# EAGLE schematic AteGates (EAGLE 6.6.0)
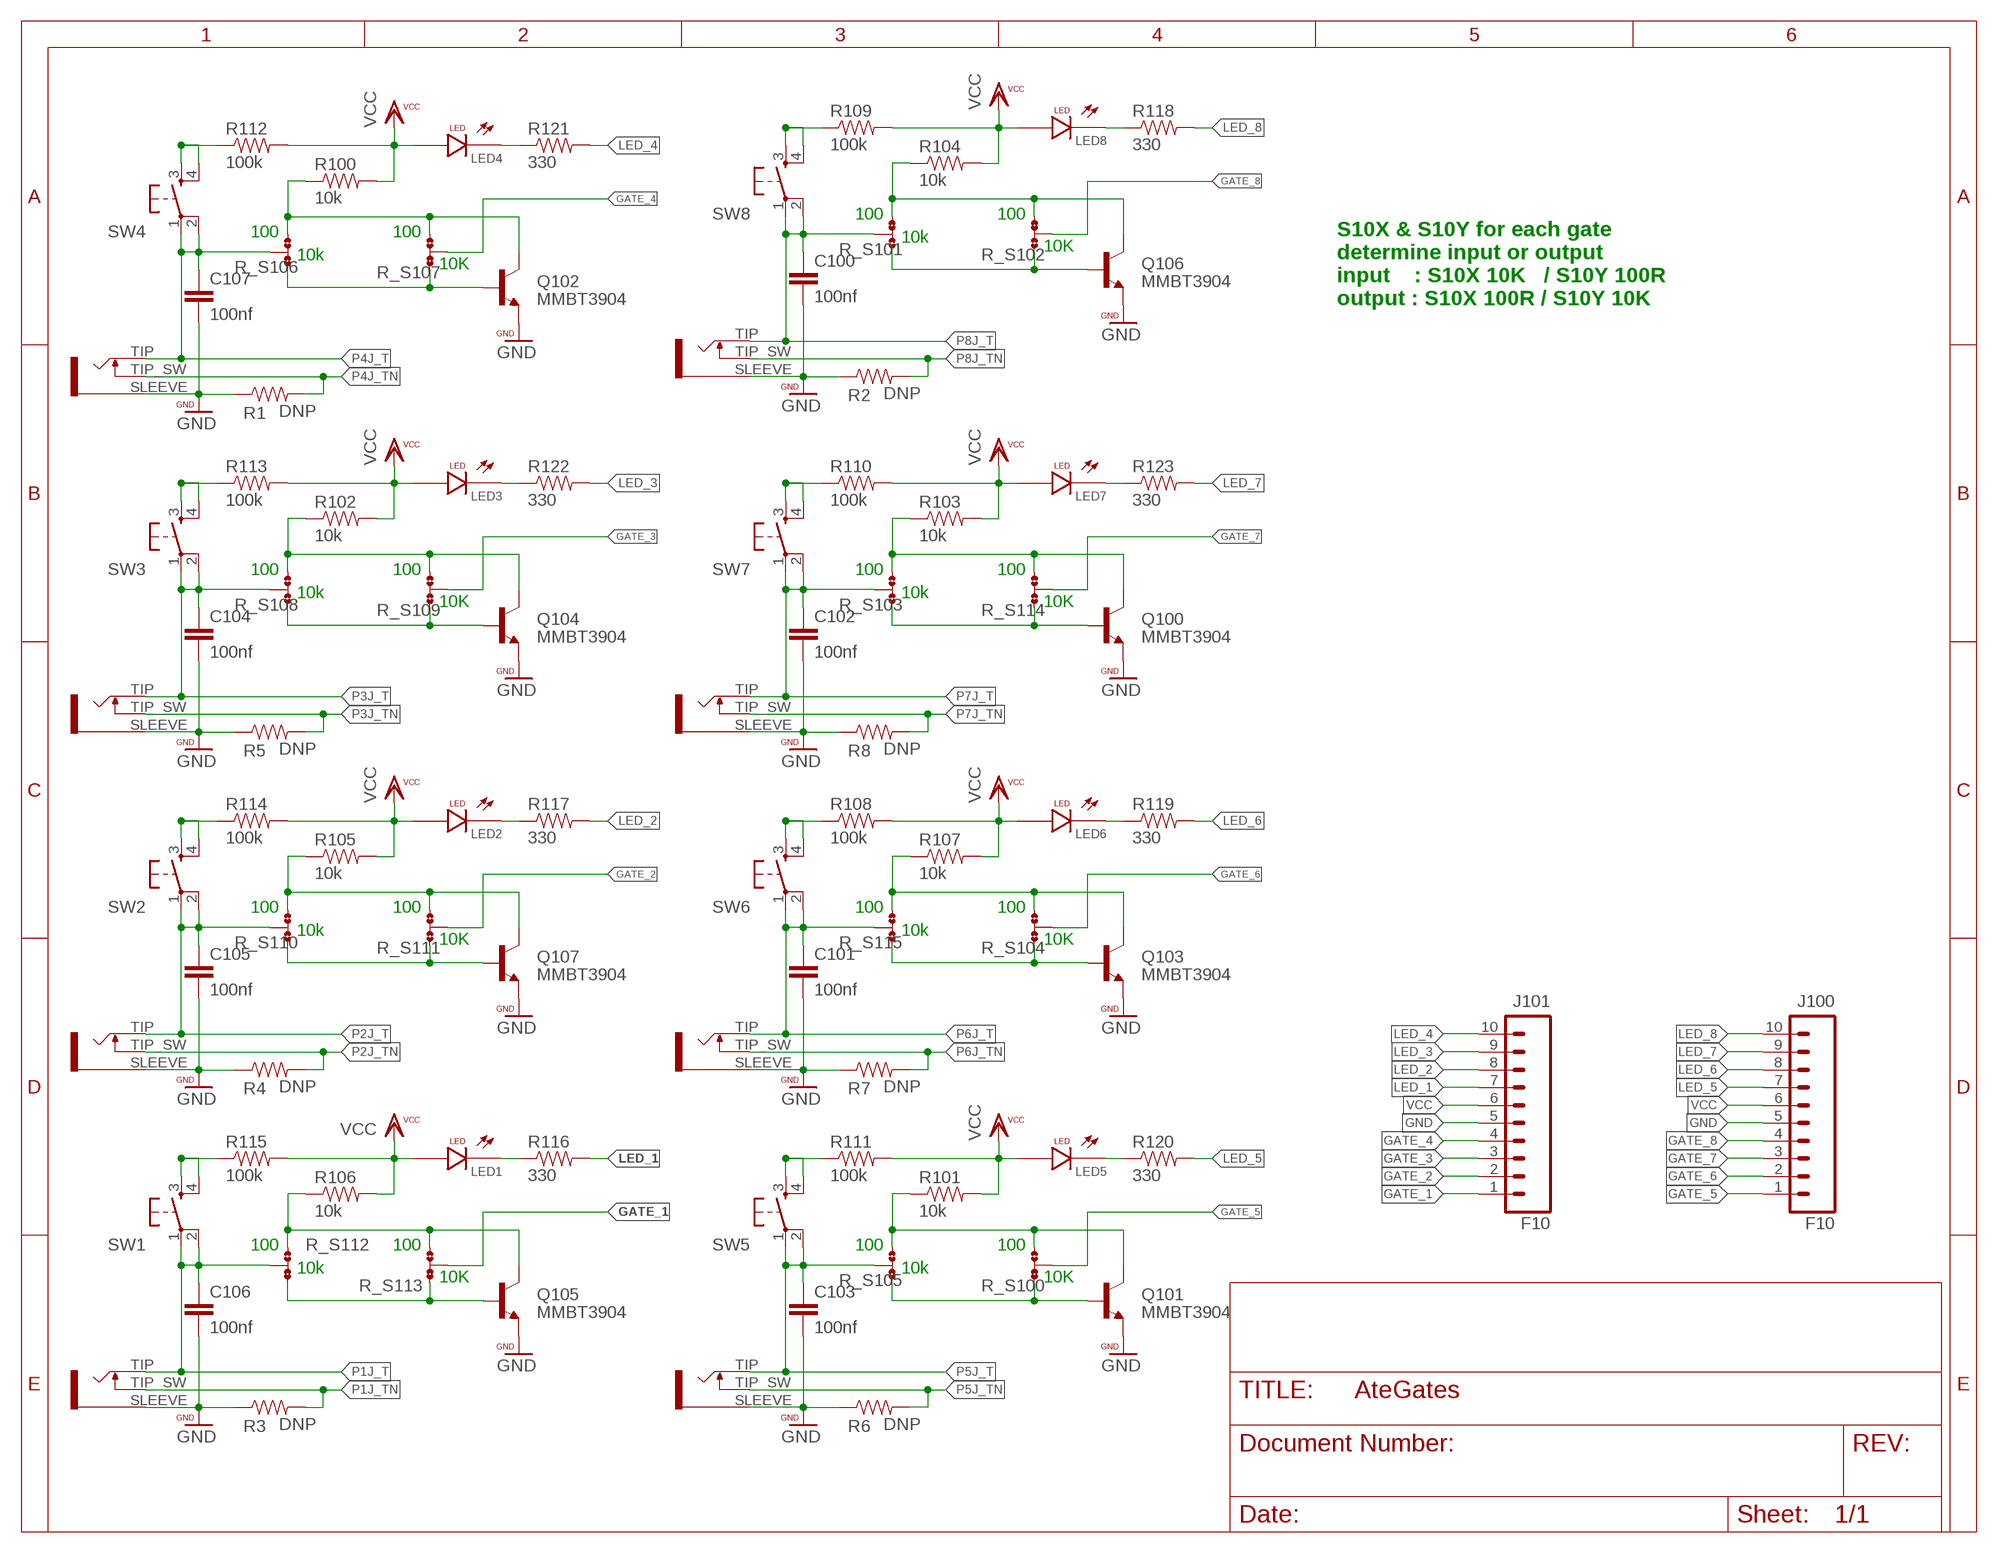
[diagram p0: schematic, sheet 1]

## Parts
C100  100nf  CAP0603-CAP  [0603-CAP]
C101  100nf  CAP0603-CAP  [0603-CAP]
C102  100nf  CAP0603-CAP  [0603-CAP]
C103  100nf  CAP0603-CAP  [0603-CAP]
C104  100nf  CAP0603-CAP  [0603-CAP]
C105  100nf  CAP0603-CAP  [0603-CAP]
C106  100nf  CAP0603-CAP  [0603-CAP]
C107  100nf  CAP0603-CAP  [0603-CAP]
J100  F10  M10SILK_FEMALE_PTH  [1X10_OCTO]
J101  F10  M10SILK_FEMALE_PTH  [1X10_OCTO]
LED1  LED  [LED3MM]
LED2  LED  [LED3MM]
LED3  LED  [LED3MM]
LED4  LED  [LED3MM]
LED5  LED  [LED3MM]
LED6  LED  [LED3MM]
LED7  LED  [LED3MM]
LED8  LED  [LED3MM]
P1J  JACK-3_5MM-MONO-SW-WQP_PJ302-12  [WQP_PJ301M-12]
P2J  JACK-3_5MM-MONO-SW-WQP_PJ302-12  [WQP_PJ301M-12]
P3J  JACK-3_5MM-MONO-SW-WQP_PJ302-12  [WQP_PJ301M-12]
P4J  JACK-3_5MM-MONO-SW-WQP_PJ302-12  [WQP_PJ301M-12]
P5J  JACK-3_5MM-MONO-SW-WQP_PJ302-12  [WQP_PJ301M-12]
P6J  JACK-3_5MM-MONO-SW-WQP_PJ302-12  [WQP_PJ301M-12]
P7J  JACK-3_5MM-MONO-SW-WQP_PJ302-12  [WQP_PJ301M-12]
P8J  JACK-3_5MM-MONO-SW-WQP_PJ302-12  [WQP_PJ301M-12]
Q100  MMBT3904  MMBT3904LT1-NPN-SOT23-BEC  [SOT23-BEC]
Q101  MMBT3904  MMBT3904LT1-NPN-SOT23-BEC  [SOT23-BEC]
Q102  MMBT3904  MMBT3904LT1-NPN-SOT23-BEC  [SOT23-BEC]
Q103  MMBT3904  MMBT3904LT1-NPN-SOT23-BEC  [SOT23-BEC]
Q104  MMBT3904  MMBT3904LT1-NPN-SOT23-BEC  [SOT23-BEC]
Q105  MMBT3904  MMBT3904LT1-NPN-SOT23-BEC  [SOT23-BEC]
Q106  MMBT3904  MMBT3904LT1-NPN-SOT23-BEC  [SOT23-BEC]
Q107  MMBT3904  MMBT3904LT1-NPN-SOT23-BEC  [SOT23-BEC]
R1  DNP  RESISTOR0603-RES  [0603-RES]
R2  DNP  RESISTOR0603-RES  [0603-RES]
R3  DNP  RESISTOR0603-RES  [0603-RES]
R4  DNP  RESISTOR0603-RES  [0603-RES]
R5  DNP  RESISTOR0603-RES  [0603-RES]
R6  DNP  RESISTOR0603-RES  [0603-RES]
R7  DNP  RESISTOR0603-RES  [0603-RES]
R8  DNP  RESISTOR0603-RES  [0603-RES]
R100  10k  RESISTOR0603-RES  [0603-RES]
R101  10k  RESISTOR0603-RES  [0603-RES]
R102  10k  RESISTOR0603-RES  [0603-RES]
R103  10k  RESISTOR0603-RES  [0603-RES]
R104  10k  RESISTOR0603-RES  [0603-RES]
R105  10k  RESISTOR0603-RES  [0603-RES]
R106  10k  RESISTOR0603-RES  [0603-RES]
R107  10k  RESISTOR0603-RES  [0603-RES]
R108  100k  RESISTOR0603-RES  [0603-RES]
R109  100k  RESISTOR0603-RES  [0603-RES]
R110  100k  RESISTOR0603-RES  [0603-RES]
R111  100k  RESISTOR0603-RES  [0603-RES]
R112  100k  RESISTOR0603-RES  [0603-RES]
R113  100k  RESISTOR0603-RES  [0603-RES]
R114  100k  RESISTOR0603-RES  [0603-RES]
R115  100k  RESISTOR0603-RES  [0603-RES]
R116  330  RESISTOR0603-RES  [0603-RES]
R117  330  RESISTOR0603-RES  [0603-RES]
R118  330  RESISTOR0603-RES  [0603-RES]
R119  330  RESISTOR0603-RES  [0603-RES]
R120  330  RESISTOR0603-RES  [0603-RES]
R121  330  RESISTOR0603-RES  [0603-RES]
R122  330  RESISTOR0603-RES  [0603-RES]
R123  330  RESISTOR0603-RES  [0603-RES]
R_S100  JMP-3-NO-0603  [JMP-3-NO-0603]
R_S101  100  JMP-3-NO-0603  [JMP-3-NO-0603]
R_S102  JMP-3-NO-0603  [JMP-3-NO-0603]
R_S103  100  JMP-3-NO-0603  [JMP-3-NO-0603]
R_S104  JMP-3-NO-0603  [JMP-3-NO-0603]
R_S105  100  JMP-3-NO-0603  [JMP-3-NO-0603]
R_S106  100  JMP-3-NO-0603  [JMP-3-NO-0603]
R_S107  JMP-3-NO-0603  [JMP-3-NO-0603]
R_S108  100  JMP-3-NO-0603  [JMP-3-NO-0603]
R_S109  JMP-3-NO-0603  [JMP-3-NO-0603]
R_S110  100  JMP-3-NO-0603  [JMP-3-NO-0603]
R_S111  JMP-3-NO-0603  [JMP-3-NO-0603]
R_S112  100  JMP-3-NO-0603  [JMP-3-NO-0603]
R_S113  JMP-3-NO-0603  [JMP-3-NO-0603]
R_S114  JMP-3-NO-0603  [JMP-3-NO-0603]
R_S115  100  JMP-3-NO-0603  [JMP-3-NO-0603]
SW1  TAC_SWITCHPTH  [TACTILE-PTH]
SW2  TAC_SWITCHPTH  [TACTILE-PTH]
SW3  TAC_SWITCHPTH  [TACTILE-PTH]
SW4  TAC_SWITCHPTH  [TACTILE-PTH]
SW5  TAC_SWITCHPTH  [TACTILE-PTH]
SW6  TAC_SWITCHPTH  [TACTILE-PTH]
SW7  TAC_SWITCHPTH  [TACTILE-PTH]
SW8  TAC_SWITCHPTH  [TACTILE-PTH]

## Nets
GATE_1: J101.1 R_S113.2
GATE_2: J101.2 R_S111.2
GATE_3: J101.3 R_S109.2
GATE_4: J101.4 R_S107.2
GATE_5: J100.1 R_S100.2
GATE_6: J100.2 R_S104.2
GATE_7: J100.3 R_S114.2
GATE_8: J100.4 R_S102.2
GND: C100.2 C101.2 C102.2 C103.2 C104.2 C105.2 C106.2 C107.2 J100.5 J101.5 P1J.SLEEVE P2J.SLEEVE P3J.SLEEVE P4J.SLEEVE P5J.SLEEVE P6J.SLEEVE P7J.SLEEVE P8J.SLEEVE Q100.E Q101.E Q102.E Q103.E Q104.E Q105.E Q106.E Q107.E R1.1 R2.1 R3.1 R4.1 R5.1 R6.1 R7.1 R8.1
GTI_1_LEDK: LED1.K(CATHODE) R116.1
GTI_1_LEDK1: LED2.K(CATHODE) R117.1
GTI_1_LEDK2: LED3.K(CATHODE) R122.1
GTI_1_LEDK3: LED4.K(CATHODE) R121.1
GTI_1_LEDK4: LED5.K(CATHODE) R120.1
GTI_1_LEDK5: LED6.K(CATHODE) R119.1
GTI_1_LEDK6: LED7.K(CATHODE) R123.1
GTI_1_LEDK7: LED8.K(CATHODE) R118.1
LED_1: J101.7 R116.2
LED_2: J101.8 R117.2
LED_3: J101.9 R122.2
LED_4: J101.10 R121.2
LED_5: J100.7 R120.2
LED_6: J100.8 R119.2
LED_7: J100.9 R123.2
LED_8: J100.10 R118.2
P1J_T: C106.1 P1J.TIP R_S112.2 SW1.1 SW1.2
P1J_TN: P1J.TIP_SW R3.2
P2J_T: C105.1 P2J.TIP R_S110.2 SW2.1 SW2.2
P2J_TN: P2J.TIP_SW R4.2
P3J_T: C104.1 P3J.TIP R_S108.2 SW3.1 SW3.2
P3J_TN: P3J.TIP_SW R5.2
P4J_T: C107.1 P4J.TIP R_S106.2 SW4.1 SW4.2
P4J_TN: P4J.TIP_SW R1.2
P5J_T: C103.1 P5J.TIP R_S105.2 SW5.1 SW5.2
P5J_TN: P5J.TIP_SW R6.2
P6J_T: C101.1 P6J.TIP R_S115.2 SW6.1 SW6.2
P6J_TN: P6J.TIP_SW R7.2
P7J_T: C102.1 P7J.TIP R_S103.2 SW7.1 SW7.2
P7J_TN: P7J.TIP_SW R8.2
P8J_T: C100.1 P8J.TIP R_S101.2 SW8.1 SW8.2
P8J_TN: P8J.TIP_SW R2.2
Q1_B: Q105.B R_S112.3 R_S113.3
Q1_B1: Q107.B R_S110.3 R_S111.3
Q1_B2: Q104.B R_S108.3 R_S109.3
Q1_B3: Q102.B R_S106.3 R_S107.3
Q1_B4: Q101.B R_S100.3 R_S105.3
Q1_B5: Q103.B R_S104.3 R_S115.3
Q1_B6: Q100.B R_S103.3 R_S114.3
Q1_B7: Q106.B R_S101.3 R_S102.3
Q1_C: Q105.C R106.1 R_S112.1 R_S113.1
Q1_C1: Q107.C R105.1 R_S110.1 R_S111.1
Q1_C2: Q104.C R102.1 R_S108.1 R_S109.1
Q1_C3: Q102.C R100.1 R_S106.1 R_S107.1
Q1_C4: Q101.C R101.1 R_S100.1 R_S105.1
Q1_C5: Q103.C R107.1 R_S104.1 R_S115.1
Q1_C6: Q100.C R103.1 R_S103.1 R_S114.1
Q1_C7: Q106.C R104.1 R_S101.1 R_S102.1
SW1: R115.1 SW1.3 SW1.4
SW2: R114.1 SW2.3 SW2.4
SW3: R113.1 SW3.3 SW3.4
SW4: R112.1 SW4.3 SW4.4
SW5: R111.1 SW5.3 SW5.4
SW6: R108.1 SW6.3 SW6.4
SW7: R110.1 SW7.3 SW7.4
SW8: R109.1 SW8.3 SW8.4
VCC: J100.6 J101.6 LED1.A(ANODE) LED2.A(ANODE) LED3.A(ANODE) LED4.A(ANODE) LED5.A(ANODE) LED6.A(ANODE) LED7.A(ANODE) LED8.A(ANODE) R100.2 R101.2 R102.2 R103.2 R104.2 R105.2 R106.2 R107.2 R108.2 R109.2 R110.2 R111.2 R112.2 R113.2 R114.2 R115.2

## Notes on the sheet
- 100 | 100
- 100 | 100
- 10k
- 10K
- 10k
- 10K
- S10X & S10Y for each gate
  determine input or output
  input    : S10X 10K   / S10Y 100R
  output : S10X 100R / S10Y 10K
- 100 | 100 | 100 | 100
- 10k | 10k
- 10K | 10K
- 100 | 100 | 100 | 100
- 10k | 10k
- 10K | 10K
- 100 | 100 | 100 | 100
- 10k | 10k
- 10K | 10K

## Library data of the parts
C100-C107 = PatternAgents-ProtoPads:CAP: Capacitor Standard 0603 ceramic capacitor, and 0.1" leaded capacitor.
J100 J101 = oXo_Connectors:M10: Header 10 Standard 10-pin 0.1" header. Use with straight break away headers (SKU : PRT-00116), right angle break away headers (PRT-00553), swiss pins (PRT-00743), machine pins (PRT-00117), and female headers (PRT-00115).; PROD_ID: CONN-11563
LED1-LED8 = halcyonmod_Optoelectronics:LED
P1J P2J P3J P4J P5J P6J P7J P8J = oXo_Connectors:JACK-3_5MM-MONO-SW: Jack, 3.5mm, RIght Angle, Though-Hole
Q100-Q107 = transistor:*-NPN-: NPN Transistror BF959 corrected 2008.03.06
R1-R8 R100-R123 = PatternAgents-ProtoPads:RESISTOR: Resistor Basic schematic elements and footprints for 0603, 1206, and PTH resistors.
R_S100-R_S115 = PatternAgents-ProtoPads:JMP-3-NO: Three Terminal Jumper - Normally Open All Pads Open (unconnected) PatternAgents ProtoPads Library Schematic and PCB layout libraries for design patterns by PatternAgents. For the CADSoft Eagle CAD program : http://www.cadsoftusa.com/download-eagle/ Source LBR : http://www.patternagents.com Github : https://github.com/PatternAgents License : http://creativecommons.org/licenses/by-sa/4.0/ (Creative Commons 4.0) THIS SOFTWARE IS PROVIDED BY THE CONTRIBUTORS "AS IS" AND WITHOUT ANY EXPRESS OR IMPLIED WARRANTIES, INCLUDING, BUT NOT LIMITED TO, THE IMPLIED WARRANTIES OF MERCHANTABILITY AND FITNESS FOR A PARTICULAR PURPOSE ARE DISCLAIMED. IN NO EVENT SHALL THE COPYRIGHT OWNER OR CONTRIBUTORS BE LIABLE FOR ANY DIRECT, INDIRECT, INCIDENTAL, SPECIAL, EXEMPLARY, OR CONSEQUENTIAL DAMAGES (INCLUDING, BUT NOT LIMITED TO, PROCUREMENT OF SUBSTITUTE GOODS OR SERVICES; LOSS OF USE, DATA, OR PROFITS; OR BUSINESS INTERRUPTION) HOWEVER CAUSED AND ON ANY THEORY OF LIABILITY, WHETHER IN CONTRACT, STRICT LIABILITY, OR TORT (INCLUDING NEGLIGENCE OR OTHERWISE) ARISING IN ANY WAY OUT OF THE USE OF THIS SOFTWARE, EVEN IF ADVISED OF THE POSSIBILITY OF SUCH DAMAGE.; BOM: EXCLUDE
SW1-SW8 = SparkFun:TAC_SWITCH: Momentary Switch Button commonly used for reset or general input. Spark Fun Electronics SKU : COM-00097